# Altium schematic sheet Peripheral2.SchDoc
size A3; PageSetup: Record=PageOptions|CenterHorizontal=True|CenterVertical=True|PrintScale=0.97|XCorrection=1.00|YCorrection=1.00|PrintKind=0|BorderSize=5000000|LeftOffset=0|BottomOffset=0|Orientation=2|PaperLength=1000|PaperWidth=1000|Scale=100|PaperSource=7|PrintQuality=-4|MediaType=1|DitherType=10|PrintScaleMode=1|PaperKind=A4|PaperIndex=9
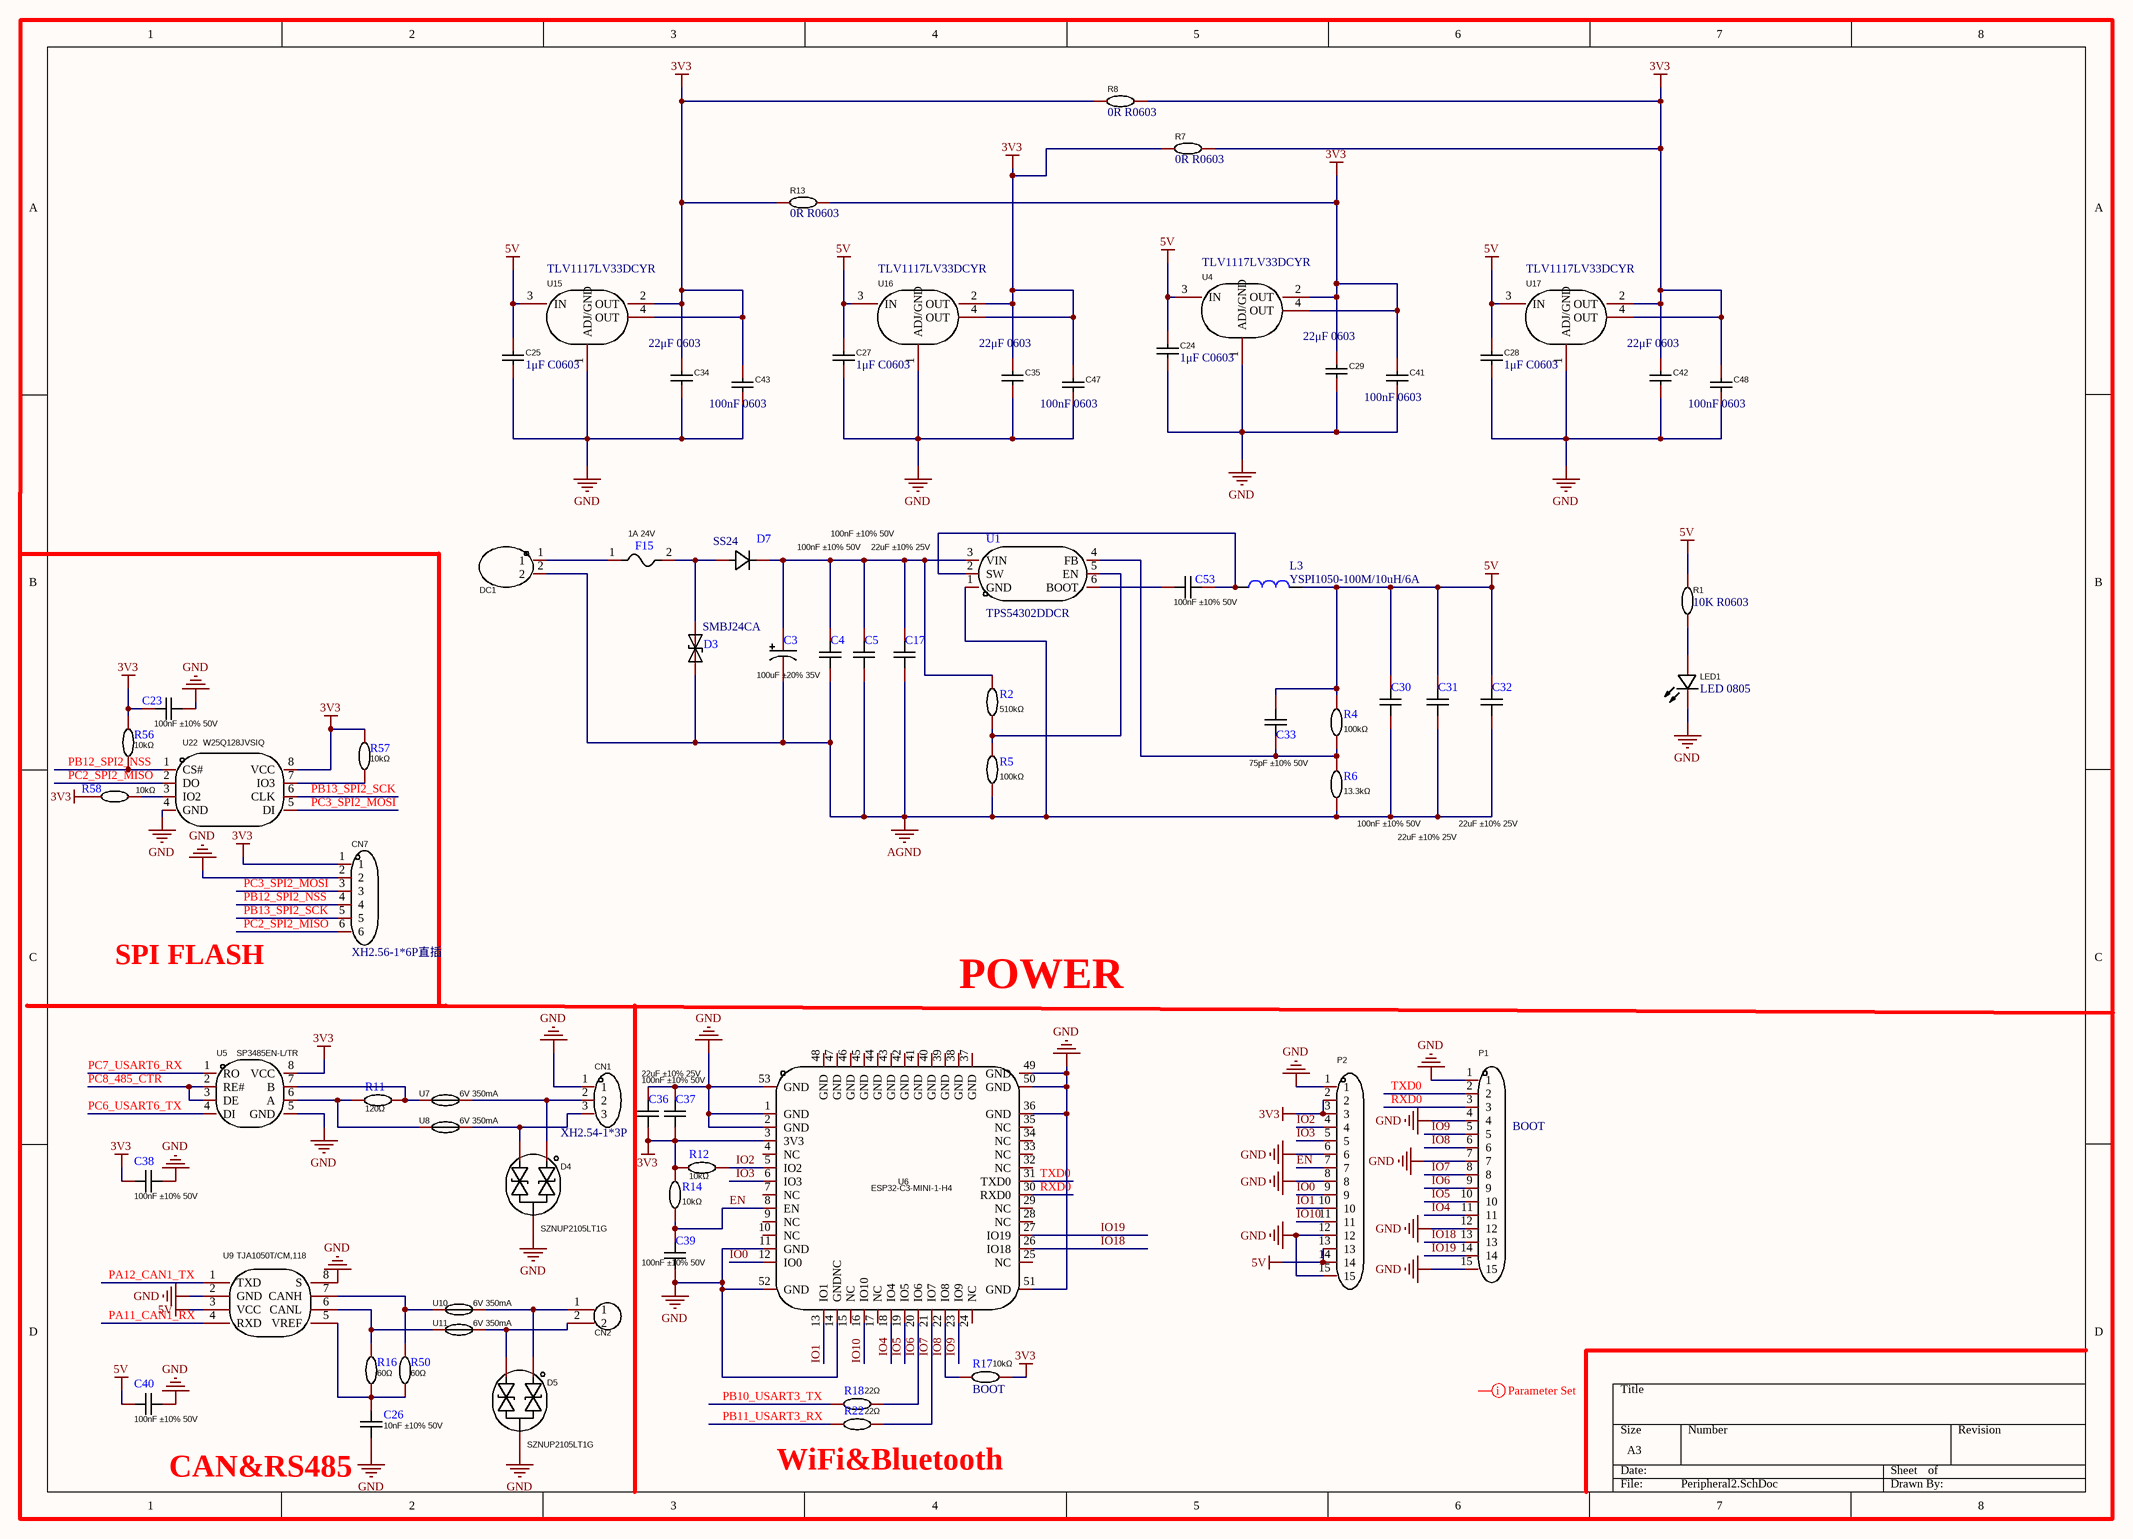
[diagram p0: Peripheral2.SchDoc]

## Parts
C3  LCSC Part Name: 100uF ±20% 35V  [CE 6.3*7.7]  (hidden comment: VES101M1VTR-0607)
C4  LCSC Part Name: 100nF ±10% 50V  [C0603]  (hidden comment: CC0603KRX7R9BB104)
C5  LCSC Part Name: 100nF ±10% 50V  [C0603]  (hidden comment: CC0603KRX7R9BB104)
C17  LCSC Part Name: 22uF ±10% 25V  [C1210]  (hidden comment: CC0603KRX7R9BB104)
C23  LCSC Part Name: 100nF ±10% 50V  [C0603]  (hidden comment: CC0603KRX7R9BB104)
C24  1μF C0603  [C0603]
C25  1μF C0603  [C0603]
C26  LCSC Part Name: 10nF ±10% 50V  [C0603]  (hidden comment: CC0603KRX7R9BB104)
C27  1μF C0603  [C0603]
C28  1μF C0603  [C0603]
C29  22μF 0603  [C0603]
C30  LCSC Part Name: 100nF ±10% 50V  [C0603]  (hidden comment: CC0603KRX7R9BB104)
C31  LCSC Part Name: 22uF ±10% 25V  [C1210]  (hidden comment: CC0603KRX7R9BB104)
C32  LCSC Part Name: 22uF ±10% 25V  [C1210]  (hidden comment: CC0603KRX7R9BB104)
C33  LCSC Part Name: 75pF ±10% 50V  [C0603]  (hidden comment: CC0603KRX7R9BB104)
C34  22μF 0603  [C0603]
C35  22μF 0603  [C0603]
C36  LCSC Part Name: 22uF ±10% 25V  [C1210]  (hidden comment: CC0603KRX7R9BB104)
C37  LCSC Part Name: 100nF ±10% 50V  [C0603]  (hidden comment: CC0603KRX7R9BB104)
C38  LCSC Part Name: 100nF ±10% 50V  [C0603]  (hidden comment: CC0603KRX7R9BB104)
C39  LCSC Part Name: 100nF ±10% 50V  [C0603]  (hidden comment: CC0603KRX7R9BB104)
C40  LCSC Part Name: 100nF ±10% 50V  [C0603]  (hidden comment: CC0603KRX7R9BB104)
C41  100nF 0603  [C0603]
C42  22μF 0603  [C0603]
C43  100nF 0603  [C0603]
C47  100nF 0603  [C0603]
C48  100nF 0603  [C0603]
C53  LCSC Part Name: 100nF ±10% 50V  [C0603]  (hidden comment: CC0603KRX7R9BB104)
CN1  XH2.54-1*3P  [XH2.54-1*3P-CONN-TH_3P-P2.50_HC-XH-3A-G]
CN2  XH-2A_C20079  [XH2.5-2]  (value not drawn)
CN7  XH2.56-1*6P直插  [H2.54-1*6P-直插CONN-TH_6P-P2.50_HC-XH-6A-G]
D3  SMBJ24CA  [SMB]
D4  SZNUP2105LT1G  [SOT-23]
D5  SZNUP2105LT1G  [SOT-23]
D7  SS24  [SMA]
DC1  A3963WV-2P  [CONN-TH_A3963WV-2P]  (value not drawn)
F15  LCSC Part Name: 1A 24V  [F1206]  (hidden comment: TLC-NSMD100/24)
L3  YSPI1050-100M/10uH/6A  [IND-SMD_L11.5-W10.0_SMMS1040]
LED1  LED 0805  [LED0805-RD_RED]
P1  KH-2.54FH-1X15P-H8.5  [HDR2.54-M-LI-15P]  (value not drawn)
P2  KH-2.54FH-1X15P-H8.5  [HDR2.54-M-LI-15P]  (value not drawn)
R1  10K R0603  [R0603]
R2  value 510kΩ  [R0603]  (hidden comment: 0603WAF5113T5E)
R4  value 100kΩ  [R0603]  (hidden comment: 0603WAF5113T5E)
R5  value 100kΩ  [R0603]  (hidden comment: 0603WAF5113T5E)
R6  value 13.3kΩ  [R0603]  (hidden comment: 0603WAF5113T5E)
R7  0R R0603  [R0603]
R8  0R R0603  [R0603]
R11  value 120Ω  [R0603]  (hidden comment: 0603WAF5113T5E)
R12  value 10kΩ  [R0603]  (hidden comment: 0603WAF5113T5E)
R13  0R R0603  [R0603]
R14  value 10kΩ  [R0603]  (hidden comment: 0603WAF5113T5E)
R16  value 60Ω  [R0603]  (hidden comment: 0603WAF5113T5E)
R17  value 10kΩ  [R0603]  (hidden comment: 0603WAF5113T5E)
R18  value 22Ω  [R0603]  (hidden comment: 0603WAF5113T5E)
R22  value 22Ω  [R0603]  (hidden comment: 0603WAF5113T5E)
R50  value 60Ω  [R0603]  (hidden comment: 0603WAF5113T5E)
R56  value 10kΩ  [R0603]  (hidden comment: 0603WAF5113T5E)
R57  value 10kΩ  [R0603]  (hidden comment: 0603WAF5113T5E)
R58  value 10kΩ  [R0603]  (hidden comment: 0603WAF5113T5E)
U1  TPS54302DDCR  [SOT23-6]
U4  TLV1117LV33DCYR  [1117LV-SOT-223_L6.7-W3.5-P2.30-BR]
U5  SP3485EN-L/TR  [SOP8_SP3485]
U6  ESP32-C3-MINI-1-H4  [WIFIM-SMD_ESP32-C3-MINI-1]
U7  LCSC Part Name: 6V 350mA  [F0603]  (hidden comment: 0603L035YR)
U8  LCSC Part Name: 6V 350mA  [F0603]  (hidden comment: 0603L035YR)
U9  TJA1050T/CM,118  [SOP8_TJA1050]
U10  LCSC Part Name: 6V 350mA  [F0603]  (hidden comment: 0603L035YR)
U11  LCSC Part Name: 6V 350mA  [F0603]  (hidden comment: 0603L035YR)
U15  TLV1117LV33DCYR  [1117LV-SOT-223_L6.7-W3.5-P2.30-BR]
U16  TLV1117LV33DCYR  [1117LV-SOT-223_L6.7-W3.5-P2.30-BR]
U17  TLV1117LV33DCYR  [1117LV-SOT-223_L6.7-W3.5-P2.30-BR]
U22  W25Q128JVSIQ  [SOIC8]

## Nets
3V3: C23.2 C29.2 C34.2 C35.2 C36.1 C37.1 C38.2 C41.2 C42.2 C43.2 C47.2 C48.2 CN7.1 P2.2 P2.3 R7.1 R7.2 R8.1 R8.2 R12.2 R13.1 R13.2 R14.2 R17.1 R56.1 R57.1 R58.2 U4.2(OUT) U4.4(OUT) U5.8(VCC) U6.3(3V3) U15.2(OUT) U15.4(OUT) U16.2(OUT) U16.4(OUT) U17.2(OUT) U17.4(OUT) U22.8(VCC)
5V: C24.2 C25.2 C27.2 C28.2 C30.2 C31.2 C32.2 C33.2 C40.2 L3.2 P2.13 P2.14 R1.2 R4.2 U4.3(IN) U9.3(VCC) U15.3(IN) U16.3(IN) U17.3(IN)
AGND: C3.2 C4.1 C5.1 C17.1 C30.1 C31.1 C32.1 D3.2(A) DC1.2 R5.1 R6.1 U1.1(GND)
GND: C23.1 C24.1 C25.1 C26.2 C27.1 C28.1 C29.1 C34.1 C35.1 C36.2 C37.2 C38.1 C39.1 C40.1 C41.1 C42.1 C43.1 C47.1 C48.1 CN1.1 CN7.2 D4.3 D5.3 LED1.1(-) P1.1 P1.4 P1.7 P1.12 P1.15 P2.1 P2.6 P2.8 P2.12 P2.15 U4.1(ADJ/GND) U5.5(GND) U6.1(GND) U6.2(GND) U6.11(GND) U6.14(GNDNC) U6.36(GND) U6.49(GND) U6.50(GND) U6.51(GND) U6.52(GND) U6.53(GND) U9.2(GND) U9.8(S) U15.1(ADJ/GND) U16.1(ADJ/GND) U17.1(ADJ/GND) U22.4(GND)
EN: C39.2 P2.7 R14.1 U6.8(EN)
IO0: P2.9 U6.12(IO0)
IO1: P2.10 U6.13(IO1)
IO2: P2.4 R12.1 U6.5(IO2)
IO3: P2.5 U6.6(IO3)
IO4: P1.11 U6.18(IO4)
IO5: P1.10 U6.19(IO5)
IO6: P1.9 R18.1 U6.20(IO6)
IO7: P1.8 R22.1 U6.21(IO7)
IO8: P1.6 R17.2 U6.22(IO8)
IO9: P1.5 U6.23(IO9)
IO10: P2.11 U6.16(IO10)
IO18: P1.13 U6.26(IO18)
IO19: P1.14 U6.27(IO19)
PA11_CAN1_RX: U9.4(RXD)
PA12_CAN1_TX: U9.1(TXD)
PB10_USART3_TX: R18.2
PB11_USART3_RX: R22.2
PB12_SPI2_NSS: CN7.4 R56.2 U22.1(CS#)
PB13_SPI2_SCK: CN7.5 U22.6(CLK)
PC2_SPI2_MISO: CN7.6 U22.2(DO)
PC3_SPI2_MOSI: CN7.3 U22.5(DI)
PC6_USART6_TX: U5.4(DI)
PC7_USART6_RX: U5.1(RO)
PC8_485_CTR: U5.2(RE#) U5.3(DE)
RXD0: P1.3 U6.30(RXD0)
TXD0: P1.2 U6.31(TXD0)
NetC3_1: C3.1 C4.2 C5.2 C17.2 D7.1(K) R2.2 U1.3(VIN)
NetC26_1: C26.1 R16.2 R50.2 U9.5(VREF)
NetC33_1: C33.1 R4.1 R6.2 U1.4(FB)
NetC53_1: C53.1 L3.1 U1.2(SW)
NetC53_2: C53.2 U1.6(BOOT)
NetCN1_2: CN1.2 D4.1 U7.2
NetCN1_3: CN1.3 D4.2 U8.2
NetCN2_1: CN2.1 D5.1 U10.2
NetCN2_2: CN2.2 D5.2 U11.2
NetD3_1: D3.1(K) D7.2(A) F15.2
NetDC1_1: DC1.1 F15.1
NetLED1_2: LED1.2(+) R1.1
NetR2_1: R2.1 R5.2 U1.5(EN)
NetR11_1: R11.1 U5.7(B) U7.1
NetR11_2: R11.2 U5.6(A) U8.1
NetR16_1: R16.1 U9.6(CANL) U11.1
NetR50_1: R50.1 U9.7(CANH) U10.1
NetR57_2: R57.2 U22.7(IO3)
NetR58_1: R58.1 U22.3(IO2)

Not connected (* = marked no-connect by the designer): U6 4(NC) 7(NC) 9(NC) 10(NC) 15(NC) 17(NC) 24(NC) 25(NC) 28(NC) 29(NC) 32(NC) 33(NC) 34(NC) 35(NC) 37(GND) 38(GND) 39(GND) 40(GND) 41(GND) 42(GND) 43(GND) 44(GND) 45(GND) 46(GND) 47(GND) 48(GND)

## Notes on the sheet
- SPI FLASH
- POWER
- (near P1) BOOT
- (near R17) BOOT
- (near R22) WiFi&Bluetooth
- CAN&RS485

## Library data of the parts
C3 = VES101M1VTR-0607: Manufacturer: lelon(立隆); Name: 100uF; Add into BOM: yes; Value: 100uF; Tolerance: ±20%; Rated Voltage: 35V; φD: 6.3mm; L: 7.7mm; Lifetime @ Temp: 1000hrs@105℃; Symbol: VES101M1VTR-0607; Device: VES101M1VTR-0607; Supplier Part: C134792; Manufacturer Part: VES101M1VTR-0607; Supplier Footprint: SMD,6.3x7.7mm; JLCPCB Part Class: Extended Part; Datasheet: https://atta.szlcsc.com/upload/public/pdf/source/20171023/C134792_15087477404271052916.pdf; Supplier: LCSC; Convert to PCB: yes; Ripple Current: -; Equivalent Series Resistance(ESR): -; Operating Temperature: -45℃~+105℃
C4 C5 C17 C23 C26 C30-C33 C36-C40 C53 = CC0603KRX7R9BB104: Manufacturer: YAGEO(国巨); Name: 100nF; Add into BOM: yes; Value: 100nF; Tolerance: ±10%; Voltage Rated: 50V; Temperature Coefficient: X7R; Symbol: CC0603KRX7R9BB104; Device: CC0603KRX7R9BB104; Supplier Part: C14663; Manufacturer Part: CC0603KRX7R9BB104; Supplier Footprint: 0603; JLCPCB Part Class: Basic Part; Datasheet: https://atta.szlcsc.com/upload/public/pdf/source/20170116/1484561234239.pdf; Supplier: LCSC; Convert to PCB: yes
C24 C25 C27-C29 C34 C35 C42 = C0805: X7R/X5R，额定电压>=25,精度=10%; Manufacturer: FH(风华); Name: 100nF; Symbol: 0805B104K500NT; Add into BOM: yes; Value: 100nF; Tolerance: ±10%; Voltage Rated: 50V; Temperature Coefficient: X7R; Device: 0805B104K500NT; LCSC Part Name: 100nF ±10% 50V; Supplier Part: C38141; Manufacturer Part: 0805B104K500NT; Supplier Footprint: 0805; JLCPCB Part Class: Extended Part; Datasheet: https://atta.szlcsc.com/upload/public/pdf/source/20170923/C38141_1506149447419988747.pdf; Supplier: LCSC; Convert to PCB: yes
C41 C43 C47 C48 = C0805: X7R/X5R，额定电压>=25,精度=10%; Manufacturer: FH(风华); Symbol: 0805B104K500NT; Add into BOM: yes; Tolerance: ±10%; Voltage Rated: 50V; Temperature Coefficient: X7R; Name: 100nF; Device: 0805B104K500NT; LCSC Part Name: 100nF ±10% 50V; Supplier Part: C38141; Manufacturer Part: 0805B104K500NT; Supplier Footprint: 0805; JLCPCB Part Class: Extended Part; Datasheet: https://atta.szlcsc.com/upload/public/pdf/source/20170923/C38141_1506149447419988747.pdf; Supplier: LCSC; Convert to PCB: yes; Value: 100nF
CN1 = XH2.54-1*3P: 直插; Manufacturer: HCTL(华灿天禄); Name: HC-XH-3A-G; Add into BOM: yes; Reference Series: XH; Pitch: 2.54mm; Pins Structure: 1x3P; Number of PINs Per Row: 3; Gender: 公型插针; Current Rating (Max): 3A; Symbol: HC-XH-3A-G; Device: HC-XH-3A-G; LCSC Part Name: XH 2.54mm 1x3P 直插; Supplier Part: C5341202; Manufacturer Part: HC-XH-3A-G; Supplier Footprint: 插件,P=2.5mm; JLCPCB Part Class: Extended Part; Datasheet: https://atta.szlcsc.com/upload/public/pdf/source/20230105/4FFD2EFD3DA44AA828171A44400F3EDE.pdf; Supplier: LCSC; Convert to PCB: yes; Number of Rows: 1; Row Spacing: 2.54mm; Mounting Style: 直插; Operating Temperature Range: -25℃~+85℃; link: https://atta.szlcsc.com/upload/public/pdf/source/20230105/4FFD2EFD3DA44AA828171A44400F3EDE.pdf
CN2 = XH-2A_C20079: Manufacturer: BOOMELE(博穆精密); Name: XH-2A; Add into BOM: yes; Reference Series: XH; Pitch: 2.5mm; Pins Structure: 1x2P; Number of PINs Per Row: 2; Symbol: XH-2A; Device: XH-2A_C20079; LCSC Part Name: XH-2A,2P,脚距2.5mm,直插; Supplier Part: C20079; Manufacturer Part: XH-2A; Supplier Footprint: 插件,P=2.5mm; JLCPCB Part Class: Extended Part; Datasheet: https://atta.szlcsc.com/upload/public/pdf/source/20151225/1457707654857.pdf; Supplier: LCSC; Convert to PCB: yes; Number of Rows: 1; Row Spacing: -; Mounting Style: -; Contact Material: -
CN7 = XH2.56-1*6P直插: Manufacturer: HCTL(华灿天禄); Name: HC-XH-6AW-G; Add into BOM: yes; Reference Series: XH; Pitch: 2.54mm; Pins Structure: 1x6P; Number of PINs Per Row: 6; Gender: 公型插针; Current Rating (Max): 3A; Symbol: HC-XH-6AW-G; Device: HC-XH-6AW-G; LCSC Part Name: XH 2.54mm 1x6P 弯插; Supplier Part: C5341212; Manufacturer Part: HC-XH-6AW-G; Supplier Footprint: 弯插,P=2.5mm; Datasheet: https://atta.szlcsc.com/upload/public/pdf/source/20230105/4FFD2EFD3DA44AA828171A44400F3EDE.pdf; Supplier: LCSC; Convert to PCB: yes; Number of Rows: 1; Row Spacing: 2.54mm; Mounting Style: 弯插; Operating Temperature Range: -25℃~+85℃
D3 = SMBJ24CA_C78416: Manufacturer: Brightking(君耀电子); Add into BOM: yes; Polarity: 双向; Reverse Stand-Off Voltage (Vrwm): 24V; Breakdown Voltage (Min): 26.7V; Peak Pulse Current (Ipp)@10/1000μs: 15.5A; Maximum Clamping Voltage: 38.9V; Name: SMBJ24CA; Symbol: SMBJ24CA_C78416; Device: SMBJ24CA_C78416; LCSC Part Name: 双向 Vrwm:24V; Supplier Part: C78416; Manufacturer Part: SMBJ24CA; Supplier Footprint: SMB(DO-214AA); JLCPCB Part Class: Extended Part; Datasheet: https://atta.szlcsc.com/upload/public/pdf/source/20160709/1468031885392.pdf; Supplier: LCSC; Convert to PCB: yes
D4 D5 = SZNUP2105LT1G: Manufacturer: onsemi(安森美); Add into BOM: yes; Name: SZNUP2105LT1G; Symbol: SZNUP2105LT1G; Device: SZNUP2105LT1G; LCSC Part Name: SZNUP2105LT1G; Supplier Part: C233494; Manufacturer Part: SZNUP2105LT1G; Supplier Footprint: SOT-23-3; JLCPCB Part Class: Extended Part; Datasheet: https://atta.szlcsc.com/upload/public/pdf/source/20180829/C233494_96D7515346DCD494B58AEC5F0195E5EF.pdf; Supplier: LCSC; Convert to PCB: yes
D7 = SS24_C2829443: Manufacturer: CJ(江苏长电/长晶); Add into BOM: yes; Diode Configuration: 独立式; Reverse Voltage (Vr): 40V; Average Rectified Current (Io): 2A; Forward Voltage (Vf@If): 550mV@2A; Reverse Leakage Current (Ir): 500uA@40V; Name: SS24; Symbol: SS24_C2829443; Device: SS24_C2829443; LCSC Part Name: 40V 2A 550mV@2A; Supplier Part: C2829443; Manufacturer Part: SS24; Supplier Footprint: SMAG; JLCPCB Part Class: Extended Part; Datasheet: https://atta.szlcsc.com/upload/public/pdf/source/20211215/D3A84FE1ADED5816729B4A876C7DC644.pdf; Supplier: LCSC; Convert to PCB: yes
DC1 = A3963WV-2P: Manufacturer: CJT(长江连接器); Add into BOM: yes; Reference Series: VH; Pitch: 3.96mm; Pins Structure: 1x2P; Number of PINs Per Row: 2; Name: A3963WV-2P; Symbol: A3963WV-2P; Device: A3963WV-2P; LCSC Part Name: VH 3.96mm 1x2P; Supplier Part: C239409; Manufacturer Part: A3963WV-2P; Supplier Footprint: 插件,P=3.96mm; JLCPCB Part Class: Extended Part; Datasheet: https://atta.szlcsc.com/upload/public/pdf/source/20230105/6EEAD9731438ED12835B23C71AA3398A.pdf; Supplier: LCSC; Convert to PCB: yes; Number of Rows: 1; Row Spacing: -; Mounting Style: -; Contact Material: 黄铜
F15 = TLC-NSMD100/24: Manufacturer: TLC(竞沃); Add into BOM: yes; Operating Voltage (Max): 24V; Current Rating (Max): 100A; Hold Current: 1A; Trip Current: 2A; Power Dissipation: 600mW; Resistance - Initial (Ri) (Min): 60mΩ; Resistance - Post Trip (R1) (Max): 280mΩ; Maximum Time to Trip: 100ms; Name: TLC-NSMD100/24; Symbol: TLC-NSMD100/24; Device: TLC-NSMD100/24; Supplier Part: C2924939; Manufacturer Part: TLC-NSMD100/24; Supplier Footprint: 1206; JLCPCB Part Class: Extended Part; Datasheet: https://atta.szlcsc.com/upload/public/pdf/source/20211202/9DD64AE932171F6A930B1738394E7F41.pdf; Supplier: LCSC; Convert to PCB: yes; Operating Temperature: -
L3 = INDUCTOR
LED1 = LED 0805: LED 0805-NCD0805R1; Manufacturer: 国星光电; Symbol: FC-2012HRK-620D; Add into BOM: yes; Illumination Color: 红色; Luminous Intensity (IF=20mA): 67~195mcd; Dominant Wavelength / Coordinate rank: 615~630nm; Name: NCD0805R1; Device: NCD0805R1; LCSC Part Name: 红灯 0805 贴片LED; Supplier Part: C84256; Manufacturer Part: NCD0805R1; Supplier Footprint: 0805; JLCPCB Part Class: Basic Part; Datasheet: https://atta.szlcsc.com/upload/public/pdf/source/20200820/C84256_F0A75A43B3EAD75808600A0514C76B99.pdf; Supplier: LCSC; Convert to PCB: yes; Mounting Type: 表面贴装
P1 P2 = KH-2.54FH-1X15P-H8.5: Manufacturer: kinghelm(金航标); Add into BOM: yes; Pitch: 2.54mm; Number of Holes: 15; Holes Structure: 1x15P; Circular Hole / Square Hole: 方孔; Current Rating (Max): 3A; Holes Direction: 顶部; Name: KH-2.54FH-1X15P-H8.5; Symbol: KH-2.54FH-1X15P-H8.5; Device: KH-2.54FH-1X15P-H8.5; LCSC Part Name: 2.54mm 1x15P; Supplier Part: C2932676; Manufacturer Part: KH-2.54FH-1X15P-H8.5; Supplier Footprint: 直插,P=2.54mm; JLCPCB Part Class: Extended Part; Datasheet: https://atta.szlcsc.com/upload/public/pdf/source/20211220/977AA415CFA981E866620A80068F25CA.pdf; Supplier: LCSC; Convert to PCB: yes; Number of Rows: 1; Row Spacing: -; Mounting Type: 直插; Voltage Rating (Max): -; Insulation Height: 8.5mm; Operating Temperature Range: -40℃~+105℃
R1 R7 R8 R13 = R0603: Manufacturer: YAGEO(国巨); Name: 68Ω; Symbol: RC0805FR-0768RL; Add into BOM: yes; Value: 68Ω; Tolerance: ±1%; Power(Watts): 125mW; Temperature Coefficient: ±100ppm/℃; Overload Voltage (Max): 150V; Device: RC0805FR-0768RL; LCSC Part Name: 68Ω ±1% 125mW; Supplier Part: C137498; Manufacturer Part: RC0805FR-0768RL; Supplier Footprint: 0805; JLCPCB Part Class: Extended Part; Datasheet: https://atta.szlcsc.com/upload/public/pdf/source/20171106/C137498_15099604779991093655.pdf; Supplier: LCSC; Convert to PCB: yes; Type: 厚膜电阻; Operating Temperature Range: -55℃~+125℃
R2 R4-R6 R11 R12 R14 R16-R18 R22 R50 R56-R58 = 0603WAF5113T5E: Manufacturer: UNI-ROYAL(厚声); Add into BOM: yes; Tolerance: ±1%; Power(Watts): 100mW; Temperature Coefficient: ±100ppm/℃; Overload Voltage (Max): 75V; Symbol: 0603WAF5113T5E; Device: 0603WAF5113T5E; LCSC Part Name: 511kΩ ±1% 100mW; Supplier Part: C23194; Manufacturer Part: 0603WAF5113T5E; Supplier Footprint: 0603; JLCPCB Part Class: Extended Part; Datasheet: https://atta.szlcsc.com/upload/public/pdf/source/20200306/C422600_1E6D84923E4A46A82E41ADD87F860B5C.pdf; Supplier: LCSC; Convert to PCB: yes; Type: 厚膜电阻; Operating Temperature Range: -55℃~+155℃
  R2: Name: 510kΩ
  R4 R5: Name: 100kΩ
  R6: Name: 13.3kΩ
  R11: Name: 120Ω
  R12 R14 R17 R56-R58: Name: 10kΩ
  R16 R50: Name: 60Ω
  R18 R22: Name: 22Ω
U1 = TPS54302DDCR: Manufacturer: TI(德州仪器); Symbol: TPS54302DDCR_C311983; Add into BOM: yes; Function: 降压型; Synchronous Rectification: 是; Output Type: 可调; Number of Outputs: 1; Topology: 降压式; Input Voltage: 4.5V~28V; Output Voltage: 596mV~28V; Output Current (Max): 3A; Switching Frequency: 400kHz; Name: TPS54302DDCR; Device: TPS54302DDCR; LCSC Part Name: 降压型 Vin=4.5V~28V Vout=596mV~28V 3A; Supplier Part: C311983; Manufacturer Part: TPS54302DDCR; Supplier Footprint: TSOT-23-6; JLCPCB Part Class: Extended Part; Datasheet: https://atta.szlcsc.com/upload/public/pdf/source/20181023/C311983_0948EE70BFAD2011B492BD3F4CEA709D.pdf; Supplier: LCSC; Convert to PCB: yes; Operating Temperature: -40℃~+125℃@(TJ)
U4 U15-U17 = TLV1117LV33DCYR: C15578 // SOT-223// TI; Manufacturer: TI(德州仪器); Add into BOM: yes; Output Type: 固定; Output Polarity: 正; Number of Outputs: 1; Maximum Input Voltage: 5.5V; Output Voltage: 3.3V; Dropout Voltage: 1.3V@(800mA); Output Current: 1A; Power Supply Rejection Ratio (PSRR): 75dB@(120Hz); Name: TLV1117LV33DCYR; Symbol: TLV1117LV33DCYR; Device: TLV1117LV33DCYR; LCSC Part Name: 正 Vin=5.5V Vout=3.3V 1A 75dB@(120Hz); Supplier Part: C15578; Manufacturer Part: TLV1117LV33DCYR; Supplier Footprint: SOT-223; JLCPCB Part Class: Extended Part; Datasheet: https://atta.szlcsc.com/upload/public/pdf/source/20140704/1457707105729.pdf; Supplier: LCSC; Convert to PCB: yes
U5 = SP3485EN-L/TR: Manufacturer: MaxLinear; Add into BOM: yes; Types: 收发器; Driver/receiver: 1/1; Data Rate: 10Mbps; Supply Voltage: 3.3V; Name: SP3485EN-L/TR; Symbol: SP3485EN-L/TR; Device: SP3485EN-L/TR; LCSC Part Name: 10Mbps; Supplier Part: C8963; Manufacturer Part: SP3485EN-L/TR; Supplier Footprint: SOIC-8_150mil; JLCPCB Part Class: Basic Part; Datasheet: https://atta.szlcsc.com/upload/public/pdf/source/20170601/1496285796963.pdf; Supplier: LCSC; Convert to PCB: yes
U6 = ESP32-C3-MINI-1U-H4: Manufacturer: ESPRESSIF(乐鑫); Add into BOM: yes; Name: ESP32-C3-MINI-1-H4; Symbol: ESP32-C3-MINI-1-H4; Device: ESP32-C3-MINI-1-H4; LCSC Part Name: ESP32-C3-MINI-1-H4; Supplier Part: C2934569; Manufacturer Part: ESP32-C3-MINI-1-H4; Supplier Footprint: 模块; JLCPCB Part Class: Extended Part; Datasheet: https://atta.szlcsc.com/upload/public/pdf/source/20220602/2F3F799AD033675D9930B69B0B580EA8.pdf; Supplier: LCSC; Convert to PCB: yes
U7 U8 U10 U11 = 0603L035YR: Manufacturer: Littelfuse(美国力特); Add into BOM: yes; Operating Voltage (Max): 6V; Current Rating (Max): 40A; Hold Current: 350mA; Trip Current: 750mA; Resistance - Initial (Ri) (Min): 200mΩ; Resistance - Post Trip (R1) (Max): 1Ω; Maximum Time to Trip: 100ms; Name: 0603L035YR; Symbol: 0603L035YR; Device: 0603L035YR; Supplier Part: C207013; Manufacturer Part: 0603L035YR; Supplier Footprint: 0603; JLCPCB Part Class: Extended Part; Datasheet: https://atta.szlcsc.com/upload/public/pdf/source/20180709/C207013_44786F09EAFC890D8A7C29FA56404C7F.pdf; Supplier: LCSC; Convert to PCB: yes; Power Dissipation: -; Operating Temperature: -40℃~+85℃
U9 = TJA1050T/CM,118: Manufacturer: NXP(恩智浦); Add into BOM: yes; Protocol: CAN总线; Supply Voltage: 4.75V ~ 5.25V; Name: TJA1050T/CM,118; Symbol: TJA1050T/CM,118; Device: TJA1050T/CM,118; LCSC Part Name: TJA1050T/CM,118; Supplier Part: C6952; Manufacturer Part: TJA1050T/CM,118; Supplier Footprint: SOIC-8_150mil; JLCPCB Part Class: Basic Part; Datasheet: https://atta.szlcsc.com/upload/public/pdf/source/20140411/1457707042917.pdf; Supplier: LCSC; Convert to PCB: yes; Type: 收发器
U22 = W25Q128JVSIQ: Manufacturer: WINBOND(华邦); Symbol: W25Q128JVSIQTR; Add into BOM: yes; Memory Format: FLASH; Memory Interface: SPI - Dual/Quad I/O; Memory Size: 128Mb (16M x 8); Voltage - Supply: 2.7V ~ 3.6V; Name: W25Q128JVSIQ; Device: W25Q128JVSIQ; LCSC Part Name: W25Q128JVSIQ; Supplier Part: C97521; Manufacturer Part: W25Q128JVSIQ; Supplier Footprint: SOIC-8_208mil; JLCPCB Part Class: Basic Part; Datasheet: https://atta.szlcsc.com/upload/public/pdf/source/20170316/1489627409956.pdf; Supplier: LCSC; Convert to PCB: yes